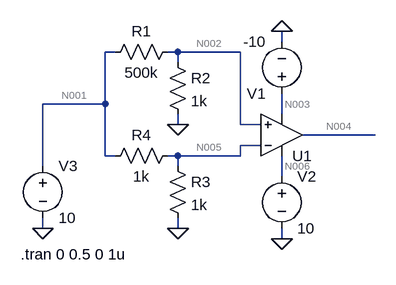
[diagram p0: schematic progetto_rete_termistore.asc]
progetto_rete_termistore.asc, the LTspice schematic file:
Version 4
SHEET 1 880 680
WIRE 288 80 288 64
WIRE 32 96 16 96
WIRE 128 96 112 96
WIRE 224 96 128 96
WIRE 128 112 128 96
WIRE 16 176 16 96
WIRE 16 176 -80 176
WIRE 288 192 288 160
WIRE 128 208 128 192
WIRE 224 208 224 96
WIRE 256 208 224 208
WIRE 432 224 320 224
WIRE 256 240 224 240
WIRE 16 256 16 176
WIRE 32 256 16 256
WIRE 128 256 112 256
WIRE 224 256 224 240
WIRE 224 256 128 256
WIRE -80 272 -80 176
WIRE 128 272 128 256
WIRE 288 288 288 256
WIRE -80 368 -80 352
WIRE 128 368 128 352
WIRE 288 384 288 368
FLAG -80 368 0
FLAG 128 368 0
FLAG 128 208 0
FLAG 288 64 0
FLAG 288 384 0
SYMBOL res 128 80 R90
WINDOW 0 0 56 VBottom 2
WINDOW 3 32 56 VTop 2
SYMATTR InstName R1
SYMATTR Value 500k
SYMBOL res 112 96 R0
SYMATTR InstName R2
SYMATTR Value 1k
SYMBOL res 112 256 R0
SYMATTR InstName R3
SYMATTR Value 1k
SYMBOL res 128 240 R90
WINDOW 0 0 56 VBottom 2
WINDOW 3 32 56 VTop 2
SYMATTR InstName R4
SYMATTR Value 1k
SYMBOL OpAmps\\UniversalOpAmp2 288 224 M180
SYMATTR InstName U1
SYMBOL voltage 288 176 R180
WINDOW 123 0 0 Left 0
WINDOW 39 0 0 Left 0
SYMATTR InstName V1
SYMATTR Value -10
SYMBOL voltage 288 272 R0
WINDOW 123 0 0 Left 0
WINDOW 39 0 0 Left 0
SYMATTR InstName V2
SYMATTR Value 10
SYMBOL voltage -80 256 R0
WINDOW 123 0 0 Left 0
WINDOW 39 0 0 Left 0
SYMATTR InstName V3
SYMATTR Value 10
TEXT -114 408 Left 2 !.tran 0 0.5 0 1u

The netlist it stands for:
* progetto_rete_termistore.asc
R1 N002 N001 500k
R2 N002 0 1k
R3 N005 0 1k
R4 N005 N001 1k
XU1 N002 N005 N006 N003 N004 level2 Avol=1Meg GBW=10Meg Slew=10Meg Ilimit=25m Rail=0 Vos=0 En=0 Enk=0 In=0 Ink=0 Rin=500Meg  ; pins In+ In- V+ V- OUT
V1 N003 0 -10
V2 N006 0 10
V3 N001 0 10
.tran 0 0.5 0 1u
.lib UniversalOpAmp2.lib
.backanno
.end

* Results of the author's LTspice run, read from the files saved beside the schematic
* Operating Point, zero values left out:
*   V(n002) = 19.96 mV
*   V(n001) = 10 V
*   V(n005) = 5 V
*   V(n004) = -10 V
*   V(n006) = 10 V
*   V(n003) = -10 V
*   I(R4) = -5 mA
*   I(R3) = 5 mA
*   I(R2) = 19.96 µA
*   I(R1) = -19.96 µA
*   I(V3) = -5.02 mA
*   I(V2) = -2.249 µA
*   I(V1) = 2.034 µA
*   Ix(u1:1) = 39.92 pA
*   Ix(u1:2) = 10 nA
*   Ix(u1:3) = 2.249 µA
*   Ix(u1:4) = -2.034 µA